# EAGLE design Mini-RS485_RJ45-GW-v01 (EAGLE 8.5.1)
MAPLE-CUx Large Version
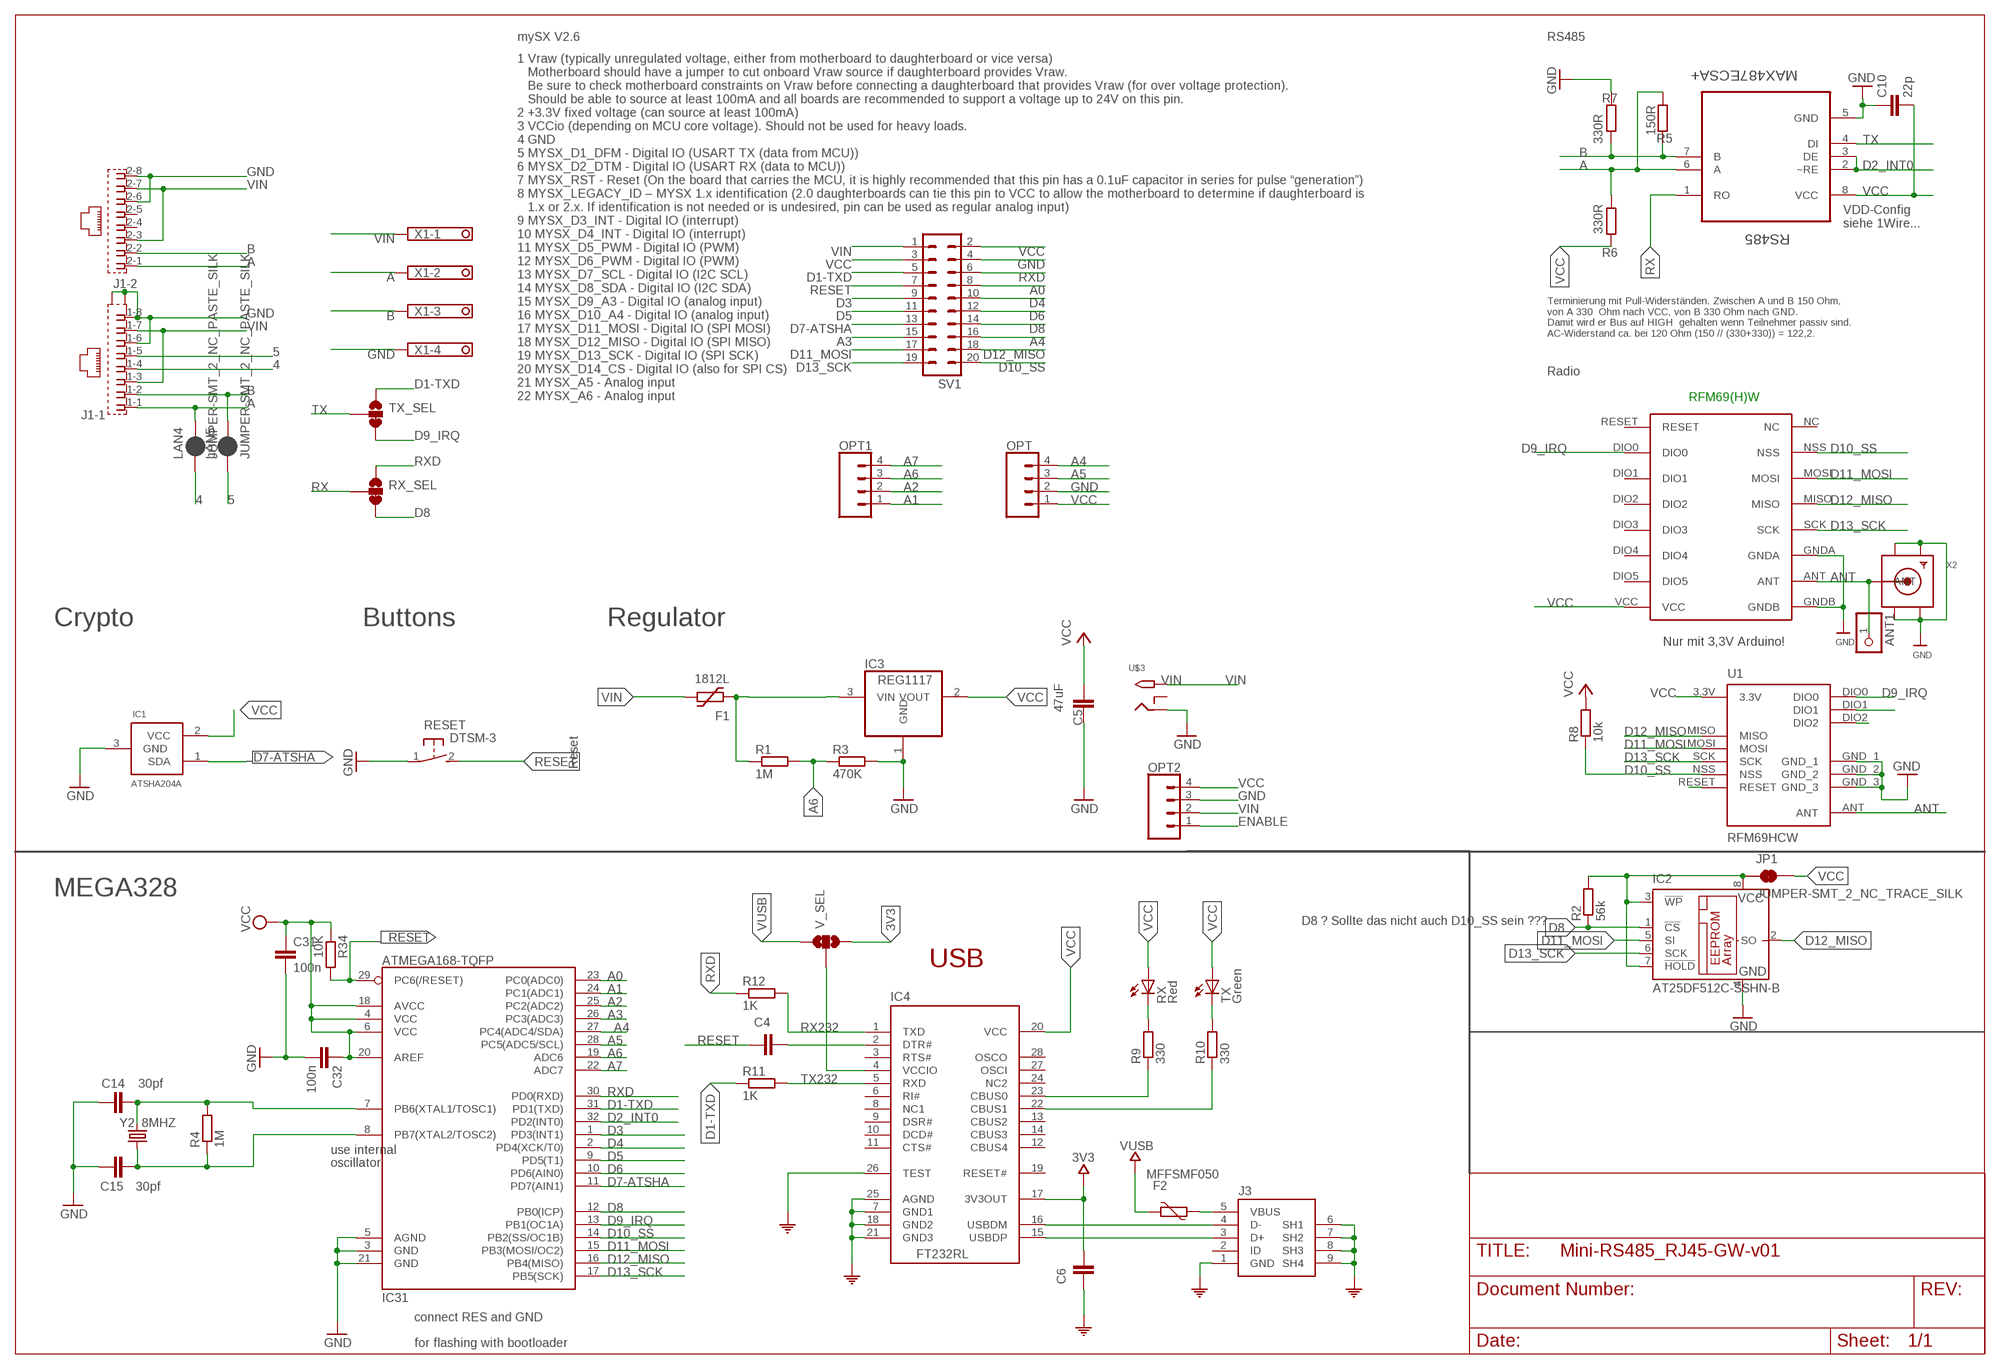
[diagram p0: schematic, sheet 1]

## Parts
ANT1  PINHD-1X1  [1X01]
C4  100nF  C-EUC0805  [C0805]
C5  47uF  C-EUC1210  [C1210]
C6  100nF  C-EUC0805  [C0805]
C10  22p  C-EUC0805  [C0805]
C14  30pf  CAP0805  [0805]
C15  30pf  CAP0805  [0805]
C31  100n  C-EUC0805  [C0805]
C32  100n  C-EUC0805  [C0805]
F1  1812L  [1812L]
F2  MFFSMF050  PTC  [0603-1608X90N]
IC1  ATSHA204A  [SOT23]
IC2  AT25DF512C-SSHN-B  25AA080SN  [SO-08]
IC3  REG1117  [SOT223]
IC4  FT232RL  0226_FT232RL  [SSOP28]
IC31  ATMEGA168-TQFP  [TQFP32-08]
J1  RJ45_2X_NARROW_SHILDPINS  [RJ45_2X_NARROW_SHILDPINS]
J3  0219_14850  [USB-MINI-B_2]
JP1  JUMPER-SMT_2_NC_TRACE_SILK  [SMT-JUMPER_2_NC_TRACE_SILK]
LAN4  JUMPER-SMT_2_NC_PASTE_SILK  [SMT-JUMPER_2_NC_PASTE_SILK]
LAN5  JUMPER-SMT_2_NC_PASTE_SILK  [SMT-JUMPER_2_NC_PASTE_SILK]
OPT  CONN_04  [1X04]
OPT1  CONN_04  [1X04]
OPT2  CONN_04  [1X04]
R1  1M  R-EU_M0805  [M0805]
R2  56k  R-EU_M0805  [M0805]
R3  470K  R-EU_R0805  [R0805]
R4  1M  R-EU_M0805  [M0805]
R5  150R  R-EU_R0805  [R0805]
R6  330R  R-EU_R0805  [R0805]
R7  330R  R-EU_R0805  [R0805]
R8  10k  R-EU_M0805  [M0805]
R9  330  R-EU_R0805  [R0805]
R10  330  R-EU_R0805  [R0805]
R11  1K  R-EU_R0805  [R0805]
R12  1K  R-EU_R0805  [R0805]
R34  10K  R-EU_R0805  [R0805]
RESET  DTSM-3  [DTSM-3]
RFM69W  RFM69HW  [RFM]
RS485  MAX487ECSA+  [SOIC127P600X175-8N]
RX  Red  0181_KTP-2012SURCK  [CHIPLED_0805]
RX_SEL  JUMPER-SMT_3_1-NC_TRACE_SILK  [SMT-JUMPER_3_1-NC_TRACE_SILK]
SV1  MA10-2  [MA10-2]
TX  Green  0043_KPT-2012SGC  [CHIPLED_0805]
TX_SEL  JUMPER-SMT_3_1-NC_TRACE_SILK  [SMT-JUMPER_3_1-NC_TRACE_SILK]
U1  RFM69HCW  [RFM69HCW-XXXS2]
U$3  2.1MMJACKTHM  [PJ-102A]
V_SEL  JUMPER-SMT_3_NO_SILK  [SMT-JUMPER_3_NO_SILK]
X1  1751264  [1751264]
X2  SMACONNECTOR_EDGE  [SMA_EDGELAUNCH]
Y2  8MHZ  CRYSTALTXC-7A  [CRYSTAL-TXC-7A]

## Nets
3V3: C6.2 IC4.17(3V3OUT) V_SEL.3
4: J1.1-4 LAN4.1
5: J1.1-5 LAN5.1
A: J1.1-1 J1.2-1 LAN4.2 R5.1 R6.2 RS485.6(A) X1.2
A0: IC31.23(PC0(ADC0)) SV1.8
A1: IC31.24(PC1(ADC1)) OPT1.1
A2: IC31.25(PC2(ADC2)) OPT1.2
A3: IC31.26(PC3(ADC3)) SV1.15
A4: IC31.27(PC4(ADC4/SDA)) OPT.4 SV1.16
A5: IC31.28(PC5(ADC5/SCL)) OPT.3
A6: IC31.19(ADC6) OPT1.3 R1.2 R3.1
A7: IC31.22(ADC7) OPT1.4
ANT: ANT1.1 RFM69W.ANT U1.ANT X2.P(ANT)
B: J1.1-2 J1.2-2 LAN5.2 R5.2 R7.1 RS485.7(B) X1.3
COM: C6.1 IC4.7(GND1) IC4.18(GND2) IC4.21(GND3) IC4.25(AGND) IC4.26(TEST) J3.1(GND) J3.6(SH1) J3.7(SH2) J3.8(SH3) J3.9(SH4)
D1-TXD: IC31.31(PD1(TXD)) R11.1 SV1.5 TX_SEL.1
D2_INT0: IC31.32(PD2(INT0)) RS485.2(~RE) RS485.3(DE)
D3: IC31.1(PD3(INT1)) SV1.9
D4: IC31.2(PD4(XCK/T0)) SV1.10
D5: IC31.9(PD5(T1)) SV1.11
D6: IC31.10(PD6(AIN0)) SV1.12
D7-ATSHA: IC1.1(SDA) IC31.11(PD7(AIN1)) SV1.13
D8: IC2.1(!CS) IC31.12(PB0(ICP)) R2.1 RX_SEL.3 SV1.14
D9_IRQ: IC31.13(PB1(OC1A)) RFM69W.DIO0 TX_SEL.3 U1.DIO0
D10_SS: IC31.14(PB2(SS/OC1B)) R8.1 RFM69W.NSS SV1.20 U1.NSS
D11_MOSI: IC2.5(SI) IC31.15(PB3(MOSI/OC2)) RFM69W.MOSI SV1.17 U1.MOSI
D12_MISO: IC2.2(SO) IC31.16(PB4(MISO)) RFM69W.MISO SV1.18 U1.MISO
D13_SCK: IC2.6(SCK) IC31.17(PB5(SCK)) RFM69W.SCK SV1.19 U1.SCK
ENABLE: OPT2.1
GND [PWR]: C5.1 C10.1 C14.1 C15.1 C31.2 C32.2 IC1.3(GND) IC2.4(GND) IC3.1(GND) IC31.3(GND) IC31.5(AGND) IC31.21(GND) J1.1-6 J1.1-8 J1.2-6 J1.2-8 J1.G1(-1:S1) J1.G3(-1:S2) OPT2.3 OPT.2 R3.2 R7.2 RESET.1 RFM69W.GNDA RFM69W.GNDB RS485.5(GND) SV1.4 U1.GND_1 U1.GND_2 U1.GND_3 U$3.RING X1.4 X2.GND@1(GND4) X2.GND@2(GND3) X2.GND@3(GND2) X2.GND@4(GND1)
N$1: IC4.4(VCCIO) V_SEL.2
N$2: IC4.22(CBUS1) R10.1
N$3: C14.2 IC31.7(PB6(XTAL1/TOSC1)) R4.2 Y2.P$2
N$4: C4.2 IC4.2(DTR#)
N$5: IC4.15(USBDP) J3.3(D+)
N$6: IC4.16(USBDM) J3.4(D-)
N$7: R9.2 RX.C
N$8: IC4.23(CBUS0) R9.1
N$9: R10.2 TX.C
N$12: U1.DIO2
N$13: U1.RESET
N$15: U1.DIO1
N$19: C15.2 IC31.8(PB7(XTAL2/TOSC2)) R4.1 Y2.P$1
N$26: F2.2 J3.5(VBUS)
RESET: C4.1 IC31.29(PC6(/RESET)) R34.2 RESET.2 SV1.7
RX: RS485.1(RO) RX_SEL.2
RX232: IC4.1(TXD) R12.2
RXD: IC31.30(PD0(RXD)) R12.1 RX_SEL.1 SV1.6
TX: RS485.4(DI) TX_SEL.2
TX232: IC4.5(RXD) R11.2
VCC [PWR]: C5.2 C10.2 C31.1 C32.1 IC1.2(VCC) IC3.2(VOUT) IC4.20(VCC) IC31.4(VCC) IC31.6(VCC) IC31.18(AVCC) IC31.20(AREF) JP1.2 OPT2.4 OPT.1 R6.1 R8.2 R34.1 RFM69W.VCC RS485.8(VCC) RX.A SV1.2 SV1.3 TX.A U1.3.3V
VCC1 [PWR]: IC2.3(!WP) IC2.7(!HOLD) IC2.8(VCC) JP1.1 R2.2
VIN [PWR]: F1.P$2 J1.1-3 J1.1-7 J1.2-3 J1.2-7 OPT2.2 SV1.1 U$3.TIP X1.1
VIN-FUSED [PWR]: F1.P$1 IC3.3(VIN) R1.1
VUSB: F2.1 V_SEL.1
Unconnected: IC4.3(RTS#) IC4.6(RI#) IC4.8(NC1) IC4.9(DSR#) IC4.10(DCD#) IC4.11(CTS#) IC4.12(CBUS4) IC4.13(CBUS2) IC4.14(CBUS3) IC4.19(RESET#) IC4.24(NC2) IC4.27(OSCI) IC4.28(OSCO) J1.2-4 J1.2-5 J3.2(ID) RFM69W.DIO1 RFM69W.DIO2 RFM69W.DIO3 RFM69W.DIO4 RFM69W.DIO5 RFM69W.NC RFM69W.RESET U$3.RING_SW

## Notes on the sheet
- mySX V2.6 | RS485
- VDD-Config
  siehe 1Wire...
- Terminierung mit Pull-Widerständen. Zwischen A und B 150 Ohm,
  von A 330  Ohm nach VCC, von B 330 Ohm nach GND. 
  Damit wird er Bus auf HIGH  gehalten wenn Teilnehmer passiv sind.
  AC-Widerstand ca. bei 120 Ohm (150 // (330+330)) = 122,2.
- Radio
- RFM69(H)W
- 1 Vraw (typically unregulated voltage, either from motherboard to daughterboard or vice versa)
     Motherboard should have a jumper to cut onboard Vraw source if daughterboard provides Vraw. 
     Be sure to check motherboard constraints on Vraw before connecting a daughterboard that provides Vraw (for over voltage protection). 
     Should be able to source at least 100mA and all boards are recommended to support a voltage up to 24V on this pin.
  2 +3.3V fixed voltage (can source at least 100mA)
  3 VCCio (depending on MCU core voltage). Should not be used for heavy loads.
  4 GND
  5 MYSX_D1_DFM - Digital IO (USART TX (data from MCU))
  6 MYSX_D2_DTM - Digital IO (USART RX (data to MCU))
  7 MYSX_RST - Reset (On the board that carries the MCU, it is highly recommended that this pin has a 0.1uF capacitor in series for pulse “generation”)
  8 MYSX_LEGACY_ID – MYSX 1.x identification (2.0 daughterboards can tie this pin to VCC to allow the motherboard to determine if daughterboard is 
     1.x or 2.x. If identification is not needed or is undesired, pin can be used as regular analog input)
  9 MYSX_D3_INT - Digital IO (interrupt)
  10 MYSX_D4_INT - Digital IO (interrupt)
  11 MYSX_D5_PWM - Digital IO (PWM)
  12 MYSX_D6_PWM - Digital IO (PWM)
  13 MYSX_D7_SCL - Digital IO (I2C SCL)
  14 MYSX_D8_SDA - Digital IO (I2C SDA)
  15 MYSX_D9_A3 - Digital IO (analog input)
  16 MYSX_D10_A4 - Digital IO (analog input)
  17 MYSX_D11_MOSI - Digital IO (SPI MOSI)
  18 MYSX_D12_MISO - Digital IO (SPI MISO)
  19 MYSX_D13_SCK - Digital IO (SPI SCK)
  20 MYSX_D14_CS - Digital IO (also for SPI CS)
  21 MYSX_A5 - Analog input
  22 MYSX_A6 - Analog input
- Crypto | Buttons | Regulator
- Nur mit 3,3V Arduino!
- Reset
- MEGA328
- D8 ? Sollte das nicht auch D10_SS sein ???
- USB
- use internal
- oscillator
- connect RES and GND
- for flashing with bootloader

## Library data of the parts
ANT1 = pinhead:PINHD-1X1: PIN HEADER
C4 C6 = resistor:C-EU: CAPACITOR, European symbol
C5 C10 C31 C32 = rcl:C-EU: CAPACITOR, European symbol
C14 C15 = doug:CAP: Capacitor Standard 0603 ceramic capacitor, and 0.1" leaded capacitor.
F1 = ptc-littlefuse:1812L
F2 = Arduino-rcl:PTC: SMD PTC; DATASHEET: http://www.bourns.com/docs/Product-Datasheets/mffsmf.pdf; DISTRIBUTOR-LINK: http://www.digikey.com/product-detail/en/bourns-inc/MF-FSMF050X-2/MF-FSMF050X-2CT-ND/2039389; DISTRIBUTOR-PN: MF-FSMF050X-2CT-ND; MANUFACTURER: Bourns Inc; MANUFACTURER-PN: MF-FSMF050X-2
IC1 = Sensor:ATSHA204A
IC2 = microchip:25*: Serial EEPROM 4K/ 8K , SPI bus; MF: MICROCHIP; MPN: 25AA080/SN; OC_FARNELL: 1816072; OC_NEWARK: 92C7351
IC3 = burr-brown:REG1117: 800mA and 1A Low Dropout (LDO) Positive Regulator 1.8V, 2.5V, 2.85V, 3.3V, 5V, and Adj; MPN: REG1117; OC_FARNELL: 1097566; OC_NEWARK: 14P6981
IC4 = IntegratedCircuits:0226_FT232RL: USB to serial UART interface -FT232RL; CASE: SSOP28; MONTHLY_USAGE: _____; PART_NUMBER: FT232RL; PRICE: _____; SUPPLIER: _____; TYPE: Circuito_Integrato
IC31 = atmel:ATMEGA168: Atmel Atmega 168/328/328P
J1 = RJ45:RJ45_2X_NARROW_SHILDPINS: RJ45 connector
J3 = Connettori:0219_14850: Usb-Mini F 90 Smd; MONTHLY_USAGE: _____; PART_NUMBER: 14850; PRICE: _____; SUPPLIER: _____; TYPE: Connettori; VALUE: USB-mini-90 -SMD
JP1 = SparkFun-Jumpers:JUMPER-SMT_2_NC_TRACE: Normally closed trace jumper This jumper has a trace between two pads so it's normally closed (NC). Use a razor knife to open the connection. For best results follow the IPC guidelines for cutting traces: Cutout at least 0.063 mm (0.005 in). Remove all loose material to clean up the cut area. Seal the cut with an approved epoxy. Reapply solder to reclose the connection.
LAN4 LAN5 = SparkFun-Jumpers:JUMPER-SMT_2_NC_PASTE: Normally closed solder jumper This jumper has an aperture in the stencil to allow solder paste to bridge the split in the wire so it's normally closed (NC). Wick off the solder to open the connection. Reapply solder to reclose the connection.
OPT OPT1 OPT2 = SparkFun-Connectors:CONN_04: Multi connection point. Often used as Generic Header-pin footprint for 0.1 inch spaced/style header connections On any of the 0.1 inch spaced packages, you can populate with these: Break Away Headers - Straight <https://www.sparkfun.com/products/116> (PRT-00116) Break Away Male Headers - Right Angle <https://www.sparkfun.com/products/553> (PRT-00553) Female Headers <https://www.sparkfun.com/products/115> (PRT-00115) Break Away Headers - Machine Pin <https://www.sparkfun.com/products/117> (PRT-00117) Break Away Female Headers - Swiss Machine Pin <https://www.sparkfun.com/products/743> (PRT-00743) For SCREWTERMINALS and SPRING TERMINALS visit here: Screw Terimnals on SparkFun.com <https://www.sparkfun.com/search/results?term=Screw+Terminals> (5mm/3.5mm/2.54mm spacing) This device is also useful as a general connection point to wire up your design to another part of your project. Our various solder wires solder well into these plated through hole pads. Hook-Up Wire - Assortment (Stranded, 22 AWG) <https://www.sparkfun.com/products/11375> (PRT-11375) Hook-Up Wire - Assortment (Solid Core, 22 AWG) <https://www.sparkfun.com/products/11367> (PRT-11367) View the entire wire category on our website here <https://www.sparkfun.com/categories/141> Special notes: Molex polarized connector foot print use with SKU : PRT-08231 with associated crimp pins and housings. 1MM SMD Version SKU: PRT-10208; PROD_ID: CONN-09696
R1 R3-R8 R34 = rcl:R-EU_: RESISTOR, European symbol
R2 R9-R12 = resistor:R-EU_: RESISTOR, European symbol
RESET = mechanics:DTSM-3: Diptronics SMD button 6x3.5 mm
RFM69W = hoperf:RFM69HW
RS485 = Maxim_By_element14_Batch_1:MAX487ECSA+: Low-Power, Slew-Rate-Limited RS-485/RS-422 Transceivers; MPN: MAX487ECSA+; OC_FARNELL: 9724532; OC_NEWARK: 68K4803; PACKAGE: SOIC-8; SUPPLIER: Maxim
RX = Opto:0181_KTP-2012SURCK: LED RED - SMD - 0805; MONTHLY_USAGE: _____; PART_NUMBER: KTP-2012SURCK; PRICE: _____; SUPPLIER: _____; TYPE: Opto
RX_SEL TX_SEL = SparkFun-Jumpers:JUMPER-SMT_3_1-NC_TRACE: Normally closed trace jumper (1 of 2 connections) This jumper has a trace between two pads so it's normally closed (NC). The other connection is normally open (NO). Use a razor knife to open the connection. For best results follow the IPC guidelines for cutting traces: Cutout at least 0.063 mm (0.005 in). Remove all loose material to clean up the cut area. Seal the cut with an approved epoxy. Reapply solder to reclose the connection, or to close the NO connection.
SV1 = con-lstb:MA10-2: PIN HEADER; OC_FARNELL: unknown; OC_NEWARK: unknown
TX = Opto:0043_KPT-2012SGC: LED GREEN - SMD-0805; MONTHLY_USAGE: _____; PART_NUMBER: KPT-2012SGC; PRICE: _____; SUPPLIER: _____; TYPE: Opto
U1 = doug:RFM69H
U$3 = adafruit:2.1MMJACK: 2.1mm x 5.5mm THM DC jack with internal switch. Digikey part #PJ-102A, 4UCON part #05537 2.1mm x 5.5mm SMT DC jack with internal switch. Digikey part #PJ-002A-SMT, 4UCON part #03267 By microbuilder.eu & adafruit.com
V_SEL = SparkFun-Jumpers:JUMPER-SMT_3_NO: Normally open jumper This jumper has three pads in close proximity to each other. Apply solder to close the connection(s).
X1 = con-phoenix-350:1751264: MKDS 1/ 4-3,5 Printklemme Nennstrom: 10 A Bemessungsspannung: 160 V Raster: 3,5 mm Polzahl: 4 Montageart: Löten Anschlussart: Schraubanschluss Anschlussrichtung vom Leiter zur Platine: 0° Source: http://eshop.phoenixcontact.com .. 1751264.pdf; MPN: 1751264; OC_FARNELL: unknown; OC_NEWARK: 10R0934
X2 = adafruit:SMACONNECTOR: SMA Connector 90° DIP SMA Connector, 50 Ohm (4UConnector: 07259)
Y2 = SparkFun-FreqCtrl:CRYSTAL: Various standard crystals. Proven footprints.

## Net classes
0 default: width 0.254 mm
1 PWR: width 0.406 mm

## Board
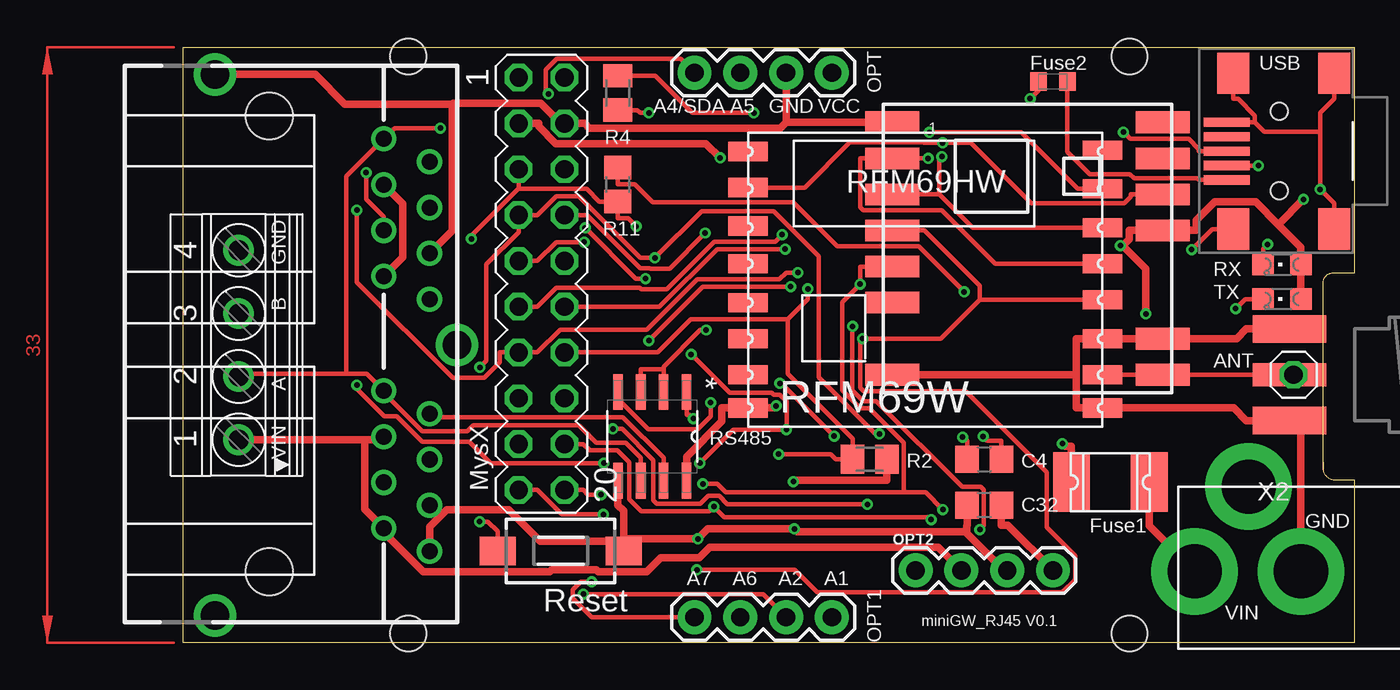
[diagram p1: board, top side]
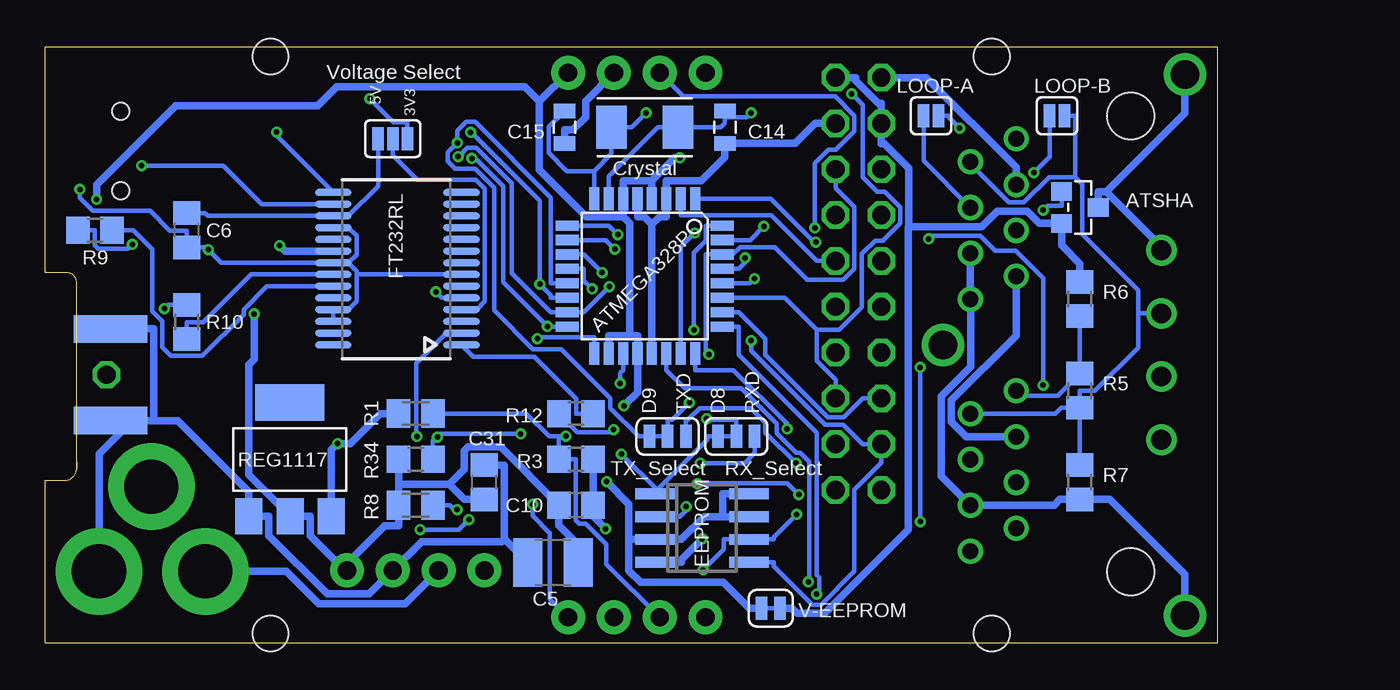
[diagram p2: board, bottom side, seen from below]

Size 65 x 33 mm. Coordinates in mm from the lower left corner, seen from the top.
Outline: 63.25,9.6 arc90 64,9 65,9 65,0 0,0 0,33 65,33 65,20.5 63.8,20.5 arc90 63.25,20 63.25,9.6
Outline: 63.25,9.6 63.25,10 63.25,9.6
Copper layers (1*16): Top 0.035mm / dielectric 1.5mm / Bottom 0.035mm
Design rules "SeeedStudio_2layer_DRU_no_angle_20140221": minimum track width 6mil, minimum drill 12mil, track to track 6mil, track to pad 6mil, pad to pad 6mil, via to via 6mil, smd to smd 0mil, copper to edge 10mil, drill to drill 10mil, minimum pad ring 10mil, minimum via ring 6mil, stop-mask expansion 2mil, vias tented up to drill 100mil, thermal gap 10mil
Holes 2 mm at 52.5,0.5 52.5,32.5 12.5,0.5 12.5,32.5
tRestrict: area 50.3,-1.7 to 54.7,2.7; area 50.3,30.3 to 54.7,34.7; area 10.3,30.3 to 14.7,34.7; area 10.3,-1.7 to 14.7,2.7
bRestrict: area 10.3,-1.7 to 14.7,2.7; area 50.3,-1.7 to 54.7,2.7; area 50.3,30.3 to 54.7,34.7; area 10.3,30.3 to 14.7,34.7

### Footprints (pad centres in the part's own frame; a part is rotated, then mirrored left to right if it is on the bottom)
1X01 = drill 1.016 octagon: 1 0,0
C0805 = smd 1.3 x 1.5: 1 -0.95,0; 2 0.95,0
C1210 = smd 1.6 x 2.7: 1 -1.4,0; 2 1.4,0
0805 = smd 0.8 x 1.2: 1 -0.9,0; 2 0.9,0
1812L = smd 2.03 x 3.3: P$1 -2.16,0; P$2 2.16,0
0603-1608X90N = smd 0.95 x 1: 1 -0.8,0; 2 0.8,0
SOT23 = smd 1.016 x 1.143: 1 -0.889,-1.016; 2 0.889,-1.016; 3 0,1.016
SO-08 = smd 0.6 x 2.2: 1 -1.905,-2.6; 2 -0.635,-2.6; 3 0.635,-2.6; 4 1.905,-2.6; 5 1.905,2.6; 6 0.635,2.6; 7 -0.635,2.6; 8 -1.905,2.6
SOT223 = smd 1.499 x 2.007: 1 -2.261,-3.15; 2 0.025,-3.15; 3 2.311,-3.15 | smd 3.81 x 2.007: 4 0,3.15
SSOP28 = smd 0.381 x 2.032: 1 0,0; 2 0.65,0; 3 1.3,0; 4 1.95,0; 5 2.6,0; 6 3.25,0; 7 3.9,0; 8 4.55,0; 9 5.2,0; 10 5.85,0; 11 6.5,0; 12 7.15,0; 13 7.8,0; 14 8.45,0; 15 8.45,7.112; 16 7.8,7.112; 17 7.15,7.112; 18 6.5,7.112; 19 5.85,7.112; 20 5.2,7.112; 21 4.55,7.112; 22 3.9,7.112; 23 3.25,7.112; 24 2.6,7.112; 25 1.95,7.112; 26 1.3,7.112; 27 0.65,7.112; 28 0,7.112
TQFP32-08 = smd 1.27 x 0.559: 1 -4.293,2.8; 2 -4.293,2; 3 -4.293,1.2; 4 -4.293,0.4; 5 -4.293,-0.4; 6 -4.293,-1.2; 7 -4.293,-2; 8 -4.293,-2.8; 17 4.293,-2.8; 18 4.293,-2; 19 4.293,-1.2; 20 4.293,-0.4; 21 4.293,0.4; 22 4.293,1.2; 23 4.293,2; 24 4.293,2.8 | smd 0.559 x 1.27: 9 -2.8,-4.293; 10 -2,-4.293; 11 -1.2,-4.293; 12 -0.4,-4.293; 13 0.4,-4.293; 14 1.2,-4.293; 15 2,-4.293; 16 2.8,-4.293; 25 2.8,4.293; 26 2,4.293; 27 1.2,4.293; 28 0.4,4.293; 29 -0.4,4.293; 30 -1.2,4.293; 31 -2,4.293; 32 -2.8,4.293
RJ45_2X_NARROW_SHILDPINS = drill 0.889: 1-1 -11.43,6.35; 1-2 -10.16,8.89; 1-3 -8.89,6.35; 1-4 -7.62,8.89; 1-5 -6.35,6.35; 1-6 -5.08,8.89; 1-7 -3.81,6.35; 1-8 -2.54,8.89; 2-1 2.54,6.35; 2-2 3.81,8.89; 2-3 5.08,6.35; 2-4 6.35,8.89; 2-5 7.62,6.35; 2-6 8.89,8.89; 2-7 10.16,6.35; 2-8 11.43,8.89 | drill 1.575 pad 2.184: G1 -15,-3; G2 0,10.414; G3 15,-3 | hole 2.6: -12.7,0; 12.573,0
USB-MINI-B_2 = smd 0.508 x 2.54: 1 0,0; 2 0.8,0; 3 1.6,0; 4 2.4,0; 5 3.2,0 | smd 2.286 x 1.778: 6 -2.717,5.948; 7 -2.717,0.36; 8 5.918,0.36; 9 5.918,5.948 | hole 0.95: -0.6,2.9; 3.8,2.9
SMT-JUMPER_2_NC_TRACE_SILK = smd 0.635 x 1.27: 1 -0.508,0; 2 0.508,0
SMT-JUMPER_2_NC_PASTE_SILK = smd 0.635 x 1.27: 1 -0.406,0; 2 0.406,0
1X04 = drill 1.016 pad 1.88: 1 0,0; 2 2.54,0; 3 5.08,0; 4 7.62,0
M0805 = smd 1.3 x 1.6: 1 -0.95,0; 2 0.95,0
R0805 = smd 1.3 x 1.5: 1 -0.95,0; 2 0.95,0
DTSM-3 = smd 2 x 1.6: 1 -3.494,0; 2 3.494,0
RFM = smd 2.184 x 1.067: ANT 19.651,2.889; DIO0 0,13.27; DIO1 0,11.143; DIO2 0,9.047; DIO3 0,6.889; DIO4 0,4.889; DIO5 0,2.889; GNDA 19.651,4.889; GNDB 19.651,1.048; MISO 19.651,9.047; MOSI 19.651,11.047; NC 19.651,15.334; NSS 19.651,13.206; RESET 0,15.27; SCK 19.651,7.048; VCC 0,1.048
SOIC127P600X175-8N = smd 1.981 x 0.533: 1 -2.464,1.905; 2 -2.464,0.635; 3 -2.464,-0.635; 4 -2.464,-1.905; 5 2.464,-1.905; 6 2.464,-0.635; 7 2.464,0.635; 8 2.464,1.905
CHIPLED_0805 = smd 1.2 x 1.2: A 0,-1.05; C 0,1.05
SMT-JUMPER_3_1-NC_TRACE_SILK = smd 0.635 x 1.27: 1 -1.016,0; 2 0,0; 3 1.016,0
MA10-2 = drill 1.016 octagon: 1 -11.43,-1.27; 2 -11.43,1.27; 3 -8.89,-1.27; 4 -8.89,1.27; 5 -6.35,-1.27; 6 -6.35,1.27; 7 -3.81,-1.27; 8 -3.81,1.27; 9 -1.27,-1.27; 10 -1.27,1.27; 11 1.27,-1.27; 12 1.27,1.27; 13 3.81,-1.27; 14 3.81,1.27; 15 6.35,-1.27; 16 6.35,1.27; 17 8.89,-1.27; 18 8.89,1.27; 19 11.43,-1.27; 20 11.43,1.27
RFM69HCW-XXXS2 = smd 3 x 1.2: 3.3V 7.5,1; ANT 7.5,-7; DIO0 7.5,3; DIO1 7.5,5; DIO2 7.5,7; GND_1 7.5,-5; GND_2 -7.5,-7; GND_3 -7.5,7; MISO -7.5,5; MOSI -7.5,3; NSS -7.5,-1; RESET -7.5,-3; SCK -7.5,1
PJ-102A = drill 3 pad 4.8: RING 0.1,-3.39; RING_SW -4.6,-6.29; TIP 0.1,-9.29
SMT-JUMPER_3_NO_SILK = smd 0.635 x 1.27: 1 -0.813,0; 2 0,0; 3 0.813,0
1751264 = drill 1.1 pad 1.7: 1 -5.25,-0.1; 2 -1.75,-0.1; 3 1.75,-0.1; 4 5.25,-0.1
SMA_EDGELAUNCH = smd 4.064 x 1.524: GND@1 2.032,-2.54; GND@2 2.032,2.54 | smd 4.064 x 1.524 bottom: GND@3 2.032,2.54; GND@4 2.032,-2.54 | smd 4.064 x 1.27: P 2.032,0
CRYSTAL-TXC-7A = smd 1.7 x 2.4: P$1 1.85,0; P$2 -1.85,0

### Placement (x,y rotation side)
ANT1  61.6,14.85 0 top
C4  44.45,10.16 0 top
C5  36.83,4.45 0 bottom
C6  57.15,22.86 90 bottom
C10  35.56,7.62 180 bottom
C14  27.3,28.57 90 bottom
C15  36.2,28.57 90 bottom
C31  40.64,8.89 90 bottom
C32  44.45,7.62 180 top
F1  51.44,8.89 0 top
F2  48.26,31.11 0 top
IC1  7.62,24.13 270 bottom
IC2  28.57,6.35 270 bottom
IC3  51.44,10.16 0 bottom
IC4  41.91,16.51 90 bottom
IC31  31.75,20.32 270 bottom
J1  4.8,16.5 270 top
J3  57.9,28.85 270 top
JP1  24.77,1.91 0 bottom
LAN4  15.88,29.21 0 bottom
LAN5  8.89,29.21 0 bottom
OPT  36,31.6 180 top
OPT1  36,1.4 180 top
OPT2  40.64,4 0 top
R1  44.45,12.7 0 bottom
R2  38.1,10.16 0 top
R3  35.56,10.16 0 bottom
R4  24.13,30.48 270 top
R5  7.62,13.97 270 bottom
R6  7.62,19.05 270 bottom
R7  7.62,8.89 270 bottom
R8  44.45,7.62 180 bottom
R9  62.23,22.86 180 bottom
R10  57.15,17.78 90 bottom
R11  24.13,25.4 90 top
R12  35.56,12.7 0 bottom
R34  44.45,10.16 0 bottom
RESET  20.95,5.08 180 top
RFM69W  31.35,11.96 0 top
RS485  26.04,11.43 270 top
RX  60.96,20.95 90 top
RX_SEL  26.67,11.43 180 bottom
SV1  19.9,19.89 270 top
TX  60.96,19.05 90 top
TX_SEL  30.48,11.43 180 bottom
U1  46.85,21.85 0 top
U$3  65.4,4.05 270 top
V_SEL  45.72,27.94 180 bottom
X1  3,16.5 90 top
X2  63.4,14.85 180 top
Y2  31.75,28.57 180 bottom

### Tracks (layer width: path | path; a pad name or v marks a point on that pad's centre or on a via)
3V3
  Bottom 0.254: C6.2 56.12,23.81 55.97,23.66 IC4.17 48.18,23.66 46.53,25.31 46.53,27.03 V_SEL.3
4
  Bottom 0.254: LAN4.1 16.28,26.71 J1.1-4
5  (via drill 0.3 pad 0.61)
  Top 0.254: J1.1-5 11.15,23.61 10.17,24.59 v10.17,26.06
  Bottom 0.254: LAN5.1 9.3,26.93 v10.17,26.06
A  (via drill 0.3 pad 0.61)
  Top 0.254: 9.07,14.9 10.21,14.9 J1.2-1 11.15,13.84 13.28,11.71 15.78,11.71 16.11,12.05 21.95,12.05 22.93,11.07 24.57,11.07 25.4,10.24 RS485.6 | X1.2 3.25,14.9 9.07,14.9 | 9.07,14.9 9.07,25.85 J1.1-1 11.75,28.53 v14.29,28.53
  Bottom 0.254: J1.2-1 10.88,13.69 8.85,13.69 R5.1 7.62,15.85 7.62,17.17 R6.2 | v14.29,28.53 14.87,29.11 14.87,29.21 LAN4.2
A0  (via drill 0.3 pad 0.61)
  Top 0.254: v28.98,22.71 27.01,20.74 25.93,20.74 25.91,20.77 25.37,20.77 22.43,23.7 22.21,23.7 SV1.8
  Bottom 0.254: IC31.23 29.75,21.94 v28.98,22.71
A1  (via drill 0.3 pad 0.61)
  Top 0.254: v37.97,7.67 30.2,7.67 29.74,8.13 29.13,8.13 28.7,7.7 26.29,7.7 26.09,7.89 26.09,10.12 24.36,11.85 v23.85,11.85
  Bottom 0.254: v23.85,11.85 23.85,12.13 26.84,15.11 28.95,15.11 IC31.24 | OPT1.1 37.01,2.41 37.01,6.07 37.97,7.04 v37.97,7.67
A2  (via drill 0.3 pad 0.61)
  Top 0.254: OPT1.2 32.18,2.68 22.22,2.68 v22.21,2.69
  Bottom 0.254: v22.21,2.69 22.09,2.82 22.09,3.61 22.21,3.74 22.21,11.64 26.54,15.97 26.54,17.52 IC31.25
A3
  Bottom 0.254: IC31.26 26.54,18.32 25.06,16.84 25.06,15.96 21.6,12.5 20.72,12.5 19.67,13.54 SV1.15
A4  (via drill 0.3 pad 0.61)
  Top 0.254: v20.28,30.42 20.13,30.57 20.13,31.76 20.74,32.37 27.61,32.37 OPT.4
  Bottom 0.254: 22.22,17.36 20.96,17.36 19.72,18.6 19.72,21.55 18.98,22.29 18.56,22.29 17.59,23.27 17.59,24.14 18.45,25 18.86,25 19.67,25.81 19.67,29.82 v20.28,30.42 | 22.22,17.36 23.98,19.12 26.54,19.12 IC31.27 | 22.22,17.36 22.22,15.63 21.17,14.59 SV1.16
A5  (via drill 0.3 pad 0.61)
  Top 0.254: v22.32,22.99 25.12,20.18 v25.66,20.18
  Bottom 0.254: v25.66,20.18 25.92,19.92 IC31.28 | OPT.3 29.6,30.28 21.2,30.28 20.13,29.21 20.13,28.35 21.16,27.32 21.57,27.32 22.32,26.58 v22.32,22.99
A6  (via drill 0.3 pad 0.61)
  Top 0.254: v33.11,14.37 33.2,14.37 v36.12,11.45
  Bottom 0.254: OPT1.3 33.88,4.36 33.88,5.44 35.03,6.59 35.38,6.59 35.58,6.79 35.58,10.16 R3.1 36.51,10.68 36.51,11.19 36.51,11.43 | 36.51,11.43 37.04,11.43 38.31,12.7 42.57,12.7 R1.2 | 36.51,11.43 36.14,11.43 v36.12,11.45 | IC31.19 32.95,15.11 33.11,14.95 v33.11,14.37
A7  (via drill 0.3 pad 0.61)
  Top 0.254: OPT1.4 22.68,1.4 21.63,2.45 21.63,2.93 22.06,3.37 v22.67,3.37
  Bottom 0.254: v22.67,3.37 22.62,3.42 22.62,10.04 23.11,10.53 23.36,10.53 24.43,11.61 24.43,12.13 26.41,14.11 29.54,14.11 30.55,15.11 IC31.22
ANT
  Top 0.254: RFM69W.ANT 52.37,14.85 U1.ANT X2.P ANT1.1
B
  Top 0.254: J1.2-2 13.88,12.5 24.41,12.5 26.67,10.24 RS485.7
  Bottom 0.254: 4.39,18.25 4.39,16.36 6.79,13.95 7.62,13.95 R5.2 | 7.89,25.81 7.5,25.42 7.5,22.65 4.39,19.54 4.39,18.25 | 4.39,18.25 X1.3 | R5.2 8.65,13.02 8.98,12.69 J1.2-2 | R5.2 R7.1 | 7.89,25.81 9.33,25.81 10.72,24.41 11.56,24.41 13.69,26.55 J1.1-2 | 7.89,25.81 7.89,29.21 LAN5.2
COM  (via drill 0.3 pad 0.61)
  Top 0.254: 63.07,28.34 63.07,29.37 63.85,30.14 J3.6 | 63.07,28.34 v63.07,25.13 63.85,24.35 J3.9 | 63.07,28.34 59.96,28.34 59.45,28.85 | J3.1 59.45,28.85 | J3.7 58.26,30.14 58.53,30.14 59.45,29.22 59.45,28.85 | v55.94,21.78 57.09,22.93 J3.8 | v55.94,21.78
  Bottom 0.254: v63.07,25.13 63.07,24.66 62.34,23.94 59.18,23.94 58.08,22.84 57.15,22.84 C6.1 56.07,21.91 v55.94,21.78 55.22,21.06 IC4.21 48.18,21.06 | 48.18,21.06 47.72,20.6 47.72,20.41 | 48.18,21.06 47.73,21.52 47.73,22.55 48.19,23.01 IC4.18 | 47.72,20.41 47.72,18.92 48.18,18.46 IC4.25 IC4.26 | 47.72,20.41 IC4.7
D1-TXD  (via drill 0.3 pad 0.61)
  Top 0.254: 18.63,25.15 SV1.5 | v16,22.39 16,22.55 18.6,25.15 18.63,25.15 | 18.63,25.15 22.4,25.15 23.1,24.45 R11.1 24.13,23.52 24.7,23.52 v25.14,23.08 | v9.66,14.28 9.66,14.07 11.18,12.55 11.87,12.55 13.29,11.13 15.9,11.13 17.08,9.95 v23.36,9.95
  Bottom 0.254: v23.36,9.95 25.06,11.65 25.06,12.18 25.87,13 28.7,13 29.36,12.34 29.46,12.34 TX_SEL.1 | v9.66,14.28 9.66,20.2 11.18,21.72 12.31,21.72 13.14,22.56 15.83,22.56 v16,22.39 | v25.14,23.08 25.9,22.32 26.54,22.32 27,22.32 IC31.31
D2_INT0  (via drill 0.3 pad 0.61)
  Top 0.254: 26.67,15.16 26.67,15.3 28.7,17.33 v29.02,17.33 | 26.67,15.16 25.4,15.16 RS485.3 | RS485.2 26.67,15.16
  Bottom 0.254: v29.02,17.33 29.02,21.63 28.37,22.28 28.37,23.12 IC31.32
D3  (via drill 0.3 pad 0.61)
  Top 0.254: v22.26,22.21 20.71,22.21 19.67,21.16 SV1.9
  Bottom 0.254: IC31.1 24.77,24.61 22.36,22.21 v22.26,22.21
D4
  Bottom 0.254: IC31.2 29.75,23.7 24.75,23.7 22.21,21.16 SV1.10
D5  (via drill 0.3 pad 0.61)
  Top 0.254: v33.24,22.62 32.85,22.23 29.46,22.23 26.83,19.6 25.42,19.6 25.35,19.67 20.71,19.67 19.67,18.62 SV1.11
  Bottom 0.254: v33.24,22.62 33.74,23.12 IC31.9
D6  (via drill 0.3 pad 0.61)
  Top 0.254: v33.4,21.82 29.63,21.82 26.44,18.62 22.21,18.62 SV1.12
  Bottom 0.254: IC31.10 33.9,22.32 v33.4,21.82
D7-ATSHA  (via drill 0.3 pad 0.61)
  Top 0.254: v9.66,23.98 9.66,19.99 14.97,14.67 16.72,14.67 17.59,15.54 17.59,16.09 SV1.13 19.67,16.09 20.94,17.36 25.74,17.36 28.53,20.14 33.09,20.14 33.46,20.51 v34.12,20.51
  Bottom 0.254: v34.12,20.51 35.13,21.52 IC31.11 | IC1.1 8.64,24.23 9.4,24.23 v9.66,23.98
D8  (via drill 0.3 pad 0.61)
  Top 0.254: 33.55,17.92 28.18,17.92 26.34,16.09 22.21,16.09 SV1.14 | 33.55,17.92 33.55,14.91 37.15,11.31 R2.1 36.22,10.16 35.93,10.46 v33.04,10.46 | v34.67,19.61 34.67,19.05 33.55,17.92
  Bottom 0.254: IC31.12 35.13,20.72 35.13,20.07 v34.67,19.61 | 31.06,8.47 v33.04,10.46 | IC2.1 31.18,8.32 31.06,8.43 31.06,8.47 | 31.06,8.47 | 31.06,8.47 28.28,11.25 28.28,11.43 RX_SEL.3
D9_IRQ  (via drill 0.3 pad 0.61)
  Top 0.254: RFM69W.DIO0 34.5,25.23 37,27.73 41.07,27.73 41.1,27.7 v42.13,27.7 43.69,27.7 47.04,24.35 52.21,24.35 52.57,24.71 52.57,24.85 U1.DIO0
  Bottom 0.254: IC31.13 36.96,19.92 36.96,24.68 41.16,28.88 41.65,28.88 42.13,28.39 v42.13,27.7 42.16,27.7 42.68,27.18 42.68,26.7 42.25,26.27 41.15,26.27 40.1,25.22 40.1,18.42 37.95,16.27 36.37,16.27 33.66,13.56 33.66,13 32.09,11.43 TX_SEL.3
D10_SS  (via drill 0.3 pad 0.61)
  Top 0.254: 39.98,8.33 41.2,8.33 v42.15,7.37 | v28.84,8.8 29.66,8.8 30.12,8.33 39.98,8.33 | 39.98,8.33 39.98,11.07 38.07,12.99 37.56,12.99 36.56,13.99 36.56,18.87 v37.57,19.88 37.57,20.85 U1.NSS | SV1.20 22.21,8.46 22.47,8.2 v23.21,8.2 | RFM69W.NSS 49.63,25.17 46.51,28.29 v41.4,28.29
  Bottom 0.254: v41.4,28.29 41.37,28.29 37.57,24.49 v37.57,19.88 36.96,19.27 36.96,19.12 IC31.14 | R8.1 42.57,7.62 42.33,7.37 v42.15,7.37 | v23.21,8.2 23.84,8.83 28.8,8.83 v28.84,8.8
D11_MOSI  (via drill 0.3 pad 0.61)
  Top 0.254: 41.96,24.85 41.96,26.8 v42.1,26.94 | v25.85,16.74 28.84,19.74 v33.71,19.74 | 41.96,24.85 U1.MOSI | RFM69W.MOSI 43.8,23.01 41.96,24.85
  Bottom 0.254: v42.1,26.94 42.07,26.94 41.58,27.43 41.09,27.43 39.13,25.47 39.13,20.49 36.96,18.32 36.47,18.32 IC31.15 35.13,18.32 v33.71,19.74 | v25.85,16.74 25.85,16.17 21.75,12.07 20.74,12.07 19.67,11.01 SV1.17 18.63,9.96 20.13,8.46 20.13,3.95 21.97,2.1 22.46,2.1 24.6,4.24 24.6,4.45 IC2.5
D12_MISO  (via drill 0.3 pad 0.61)
  Top 0.254: v41.34,26.85 41.13,26.85 U1.MISO 37.57,26.85 37.57,24.13 37.73,23.97 42.1,23.97 45.06,21.01 49.63,21.01 RFM69W.MISO | v44.21,6.26 44.43,6.48 44.43,8.49 44.27,8.65 43.22,8.65 38.47,13.39 37.73,13.39 37.12,14 37.12,17.52 v37.14,17.54 | SV1.18 22.21,11.01 22.56,10.65 24.1,10.65 24.77,9.98 24.77,7.95 25.42,7.29 29.2,7.29 v29.45,7.54 30.04,6.95 41.36,6.95 v41.49,6.82
  Bottom 0.254: v41.34,26.85 41.15,26.85 39.6,25.3 39.6,19.99 v37.14,17.54 36.97,17.54 36.96,17.52 IC31.16 | v29.45,7.54 29.45,7.33 29.8,6.99 IC2.2 | v41.49,6.82 42.06,6.26 v44.21,6.26
D13_SCK  (via drill 0.3 pad 0.61)
  Top 0.254: v28.51,4.03 33.93,4.03 35.17,2.78 48.77,2.78 49.48,3.49 49.48,4.81 47.91,6.39 47.91,9.45 43.43,13.93 37.77,13.93 37.57,14.13 37.57,16.71 v37.71,16.85 42.03,16.85 44.19,19.01 | 44.19,19.01 44.19,19.79 41.13,22.85 U1.SCK | 44.19,19.01 49.99,19.01 RFM69W.SCK | v23.33,7.11 21.03,7.11 19.67,8.46 SV1.19
  Bottom 0.254: v28.51,4.03 27.35,5.18 27.35,5.71 IC2.6 25.29,5.71 24.6,5.71 24.6,5.84 v23.33,7.11 | IC31.17 34.55,16.94 37.62,16.94 v37.71,16.85
GND  (via drill 0.3 pad 0.61)
  Top 0.406: 43.47,6.15 43.47,6.49 43.5,6.51 C32.2 | OPT2.3 45.53,4 43.47,6.05 43.47,6.15 | 43.47,6.15 34.07,6.15 v33.91,6.31 29.12,6.31 v28.56,5.75 24.59,5.75 24.45,5.61 | 33.46,28.85 OPT.2 | 33.46,28.85 33.13,28.52 22.55,28.52 22.29,28.79 SV1.4 20.97,28.79 19.85,29.91 15.02,29.91 14.95,29.84 | 33.46,28.85 37.49,28.85 U1.GND_3 | J1.G1 7.34,31.5 9,29.84 14.95,29.84 | 14.95,29.84 14.95,22.84 J1.1-6 | 14.29,7.01 13.69,6.41 J1.2-8 | 24.45,5.61 19.84,5.61 18.08,7.37 14.64,7.37 14.29,7.01 | J1.2-6 14.29,7.01 | X2.GND@1 58.98,17.39 58.44,16.85 U1.GND_1 52.45,16.85 RFM69W.GNDA 49.55,16.85 49.55,14.85 | 49.55,14.85 49.55,13.01 RFM69W.GNDB 58.28,13.01 58.98,12.31 X2.GND@2 62.01,11.67 U$3.RING | 49.55,14.85 41.21,14.85 U1.GND_2 | 24.45,5.61 24.45,6.24 24.45,7.3 24.13,7.62 RS485.5 | RESET.1 24.45,5.61
  Bottom 0.406: 60.17,12.31 62.01,10.47 U$3.RING | 60.17,12.31 58.98,12.31 | X2.GND@2 60.17,12.31 | 58.98,12.31 57.64,12.31 53.7,8.37 IC3.1 52.59,7.01 52.59,5.93 49.36,2.7 47.02,2.7 OPT2.3 44.12,5.6 39.69,5.6 39.53,5.75 | 58.98,12.31 58.98,17.39 X2.GND@1 | 39.53,5.75 C5.1 | 39.53,5.75 39.53,9.84 C31.2 | v33.91,6.31 34.61,7.01 C10.1 R3.2 | C15.1 36.2,28.43 35.73,28.43 35.03,29.13 35.03,30.03 OPT.2 | J1.G1 1.8,29.35 6.16,24.99 | 6.16,24.99 6.6,24.99 IC1.3 | 6.16,24.99 3.1,21.93 X1.4 | SV1.4 22.29,28.79 23.4,27.68 C14.1 27.3,26.92 28.62,25.6 30.55,25.6 IC31.3 30.55,23.62 30.92,23.62 31.35,23.19 | IC2.4 29.72,4.45 29.72,4.59 v28.56,5.75 | 31.35,23.19 IC31.21 | 31.35,23.19 31.78,23.62 32.15,23.62 IC31.5 | J1.G3 1.8,3.77 5.97,7.94 R7.2 8.73,7.94 9.06,7.61 J1.2-6 15.3,9.22 15.3,13.67 13.68,15.3 13.68,19.02 J1.1-8 J1.1-6
N$1
  Bottom 0.254: V_SEL.2 45.72,27.03 44.35,25.66 41.12,25.66 40.61,25.16 40.61,18.92 41.07,18.46 IC4.4
N$2
  Bottom 0.254: R10.1 57.15,17.76 56.22,17.76 53.57,20.41 IC4.22
N$3  (via drill 0.3 pad 0.61)
  Top 0.254: R4.2 25.21,29.53 25.37,29.37 v25.85,29.37
  Bottom 0.254: 27.3,29.14 26.08,29.14 v25.85,29.37 | 27.3,29.14 27.3,28.8 27.53,28.57 Y2.P$2 31.03,28.57 33.75,25.85 33.75,25.53 IC31.7 | C14.2 27.3,29.14
N$4  (via drill 0.3 pad 0.61)
  Top 0.254: C4.2 45.4,11.19 44.63,11.19 v44.39,11.43
  Bottom 0.254: IC4.2 42.75,17.16 44.43,15.48 44.43,11.47 v44.39,11.43
N$5  (via drill 0.3 pad 0.61)
  Top 0.254: v52.16,28.3 52.53,27.93 55.78,27.93 56.35,27.36 56.35,27.25 J3.3
  Bottom 0.254: IC4.15 52.16,28.1 v52.16,28.3
N$6  (via drill 0.3 pad 0.61)
  Top 0.254: v59.64,26.45 59.45,26.45 J3.4
  Bottom 0.254: IC4.16 52.98,24.31 55.12,26.45 v59.64,26.45
N$7  (via drill 0.3 pad 0.61)
  Top 0.254: v60.16,22.08 59.91,21.83 RX.C
  Bottom 0.254: v60.16,22.08 60.41,21.82 62.04,21.82 62.25,22.03 62.25,22.86 R9.2
N$8
  Bottom 0.254: R9.1 60.11,22.86 59.06,21.8 59.06,18.37 58.5,17.81 58.5,16.38 58.02,15.9 56.28,15.9 54,18.19 54,18.47 52.7,19.76 IC4.23
N$9  (via drill 0.3 pad 0.61)
  Top 0.254: TX.C 58.91,19.05 v58.38,18.52
  Bottom 0.254: R10.2 58.18,18.73 58.18,18.72 v58.38,18.52
N$19  (via drill 0.3 pad 0.61)
  Top 0.254: R4.1 26.19,31.43 28.25,29.37 v31.68,29.37
  Bottom 0.254: 34.55,26.15 34.55,25.53 IC31.8 | 34.55,26.15 33.6,27.1 Y2.P$1 32.47,28.57 v31.68,29.37 | 34.55,26.15 36.07,26.15 37.07,27.15 37.07,28.6 C15.2
N$26
  Top 0.254: J3.5 56.35,25.65 56.25,25.75 52.75,25.75 52.52,25.98 50.29,25.98 49.06,27.21 F2.2
RESET  (via drill 0.3 pad 0.61)
  Top 0.254: v38.62,11.57 38.4,11.57 35.26,14.71 35.26,21.43 32.77,23.92 28.78,23.92 v26.18,21.33 25.38,21.33 21.96,24.75 20.71,24.75 19.67,23.7 SV1.7 18.63,23.23 18.63,22.77 16.84,20.98 16.84,15.62 v16.48,15.26 | v16.47,6.7 16.92,6.7 17.46,6.16 RESET.2 | v43.25,11.4 43.46,11.19 43.5,11.19 C4.1
  Bottom 0.254: v38.62,11.57 43.08,11.57 v43.25,11.4 43.46,11.19 43.5,11.19 C4.1 | v16.48,15.26 16.48,6.71 v16.47,6.7 | v26.18,21.33 26.18,21.08 26.54,20.72 IC31.29
RX  (via drill 0.3 pad 0.61)
  Top 0.254: v28.31,12.41 28.1,12.62 27.94,12.62 RS485.1
  Bottom 0.254: v28.31,12.41 28.24,12.34 26.67,12.34 RX_SEL.2
RX232
  Bottom 0.254: IC4.1 41.26,15.86 37.87,15.86 35.54,13.53 35.54,12.7 R12.2
RXD  (via drill 0.3 pad 0.61)
  Top 0.254: v28.19,15.99 30.32,13.85 32.66,13.85 32.76,13.75 33.11,13.75 33.49,13.38 v33.49,11.81 v33.48,11.81 30.53,11.81 v28.68,9.96
  Bottom 0.254: SV1.6 21.17,25.2 20.13,24.16 20.13,20.73 20.73,20.12 22.75,20.12 24.54,21.91 26.46,21.91 26.86,21.52 IC31.30 28.37,21.52 28.37,16.17 v28.19,15.99 | v33.48,11.81 33.62,11.67 35.48,11.67 R12.1 | v28.68,9.96 26.21,9.96 25.65,10.52 RX_SEL.1
TX  (via drill 0.3 pad 0.61)
  Top 0.254: RS485.4 24.13,13.51 25.81,11.83 28.56,11.83 29.27,12.54 v29.27,13.31 | v29.27,13.31
  Bottom 0.254: TX_SEL.2 30.48,12.34 30.23,12.34 v29.27,13.31
TX232  (via drill 0.3 pad 0.61)
  Top 0.254: R11.2 24.13,25.42 25.06,25.42 26.06,24.42 33.84,24.42 36.29,21.97 40.81,21.97 v43.33,19.44
  Bottom 0.254: IC4.5 43,19.11 v43.33,19.44
VCC  (via drill 0.3 pad 0.61)
  Top 0.406: 60.75,23.17 v62.15,24.57 | 60.75,23.17 59.49,24.43 57.22,24.43 56.21,23.42 56.21,22.85 U1.3.3V 52.49,22.85 52.49,22.37 52.13,22.01 | 60.75,23.17 62.01,21.91 RX.A TX.A | 52.13,22.01 53.41,20.73 v53.41,18.22 | v51.99,22.01 52.13,22.01 | RS485.8 27.94,10.31 29.9,12.28 29.9,13.01 RFM69W.VCC 31.39,13.01 32.8,13.01 32.8,13.02 v32.9,13.13 | v29.8,26.87 29,27.67 20.7,27.67 19.75,28.62 19.75,28.79 SV1.3 | OPT2.4 45.75,6.51 45.4,6.51 R8.2
  Bottom 0.406: IC31.18 33.75,17.02 32.58,17.02 | 32.58,17.02 32.57,17.02 32.15,17.02 IC31.20 32.15,13.88 v32.9,13.13 | 32.95,23.62 32.58,23.25 32.58,17.02 | 37.59,30.01 37.59,26.23 34.98,23.62 32.95,23.62 | 37.59,30.01 38.4,30.82 48.84,30.82 49.88,29.77 57.76,29.77 62.15,25.38 v62.15,24.57 | OPT.1 37.59,30.01 | 32.95,23.62 IC31.6 32.95,25.6 31.35,25.6 | v51.99,22.01 51.69,21.71 IC4.20 | v53.41,18.22 53.41,15.7 53.7,15.42 53.7,9.3 IC3.2 50.3,7.01 50.3,5.93 48.75,4.38 48.26,4.38 | 17.11,23.07 17.14,23.03 17.14,6.25 21.77,1.62 23.3,1.62 23.58,1.91 JP1.2 | 31.35,25.6 30.08,26.87 v29.8,26.87 | 42.58,8.78 41.75,9.61 41.75,10.64 41.55,10.85 39.74,10.85 C10.2 36.51,7.42 | C5.2 35.43,5.43 36.51,6.51 36.51,7.42 | 42.58,8.78 41.75,7.94 C31.1 | 45.4,8.78 42.58,8.78 | C10.2 36.51,7.42 | R34.1 45.4,8.78 | IC31.4 31.35,25.6 | 17.11,23.07 17.11,26.3 18.47,27.67 18.63,27.67 SV1.3 18.63,29.9 18.79,29.9 20.05,31.17 20.05,31.32 SV1.2 | 17.11,23.07 13.05,23.07 12.21,23.91 10.54,23.91 9.87,23.24 IC1.2 8.64,22.02 7.62,21.01 R6.1 | 45.4,8.78 R8.2 45.4,6.46 46.18,6.46 48.26,4.38 | OPT2.4 48.26,4.38
VCC1  (via drill 0.3 pad 0.61)
  Top 0.406: v33.87,8.92 33.95,9 39.05,9 R2.2
  Bottom 0.406: 32.63,5.71 32.63,3.99 31.98,3.34 27.38,3.34 25.95,1.91 JP1.1 | 27.43,6.99 28.45,6.99 29.72,5.71 IC2.3 32.63,5.71 | 32.63,5.71 32.63,7.68 v33.87,8.92 | 27.43,6.99 26.7,6.99 IC2.7 | IC2.8 27.43,8.26 27.43,6.99
VIN
  Top 0.406: U$3.TIP 53.59,6.46 F1.P$2 | 10.1,11.25 10.1,7.39 J1.2-7 11.15,6.12 13.35,3.92 20.36,3.92 20.47,4.03 22.94,4.03 23.05,3.92 25.72,3.92 26.52,4.71 28.64,4.71 29.22,5.29 41.88,5.29 OPT2.2 | J1.1-7 12.2,21.36 12.2,24.34 J1.1-3 | 10.1,11.25 10.98,11.25 J1.2-3 | X1.1 10.1,11.25
  Bottom 0.406: OPT2.2 45.03,2.15 49.83,2.15 51.64,3.95 U$3.TIP | J1.1-7 11.15,17.03 14.74,13.43 14.74,12.25 13.91,11.42 J1.2-3 | SV1.1 17.51,31.32 16.13,31.32 11.15,26.35 J1.1-3
VIN-FUSED  (via drill 0.3 pad 0.61)
  Top 0.406: v48.78,11.04 48.92,10.9 49.27,10.9 F1.P$1
  Bottom 0.406: IC3.3 49.12,8.37 49.12,10.7 v48.78,11.04 48.07,11.04 46.41,12.7 R1.1
VUSB  (via drill 0.3 pad 0.61)
  Top 0.254: v46.99,30.16 47.46,30.62 F2.1
  Bottom 0.254: v46.99,30.16 45.69,28.85 44.91,28.85 V_SEL.1
(copper drawn outside any net)
  shapes: Top area x1

### Text on the board
tNames: Fuse2 | USB | A4/SDA | A5 | GND | VCC | OPT | R4 | R11 | GND | RX | TX | B | ANT | A | RS485 | VIN | R2 | C4 | MysX | C32 | Fuse1 | GND | A7 | A6 | A2 | A1 | Reset | miniGW_RJ45 V0.1 | VIN | OPT1
bNames: Voltage Select | LOOP-B | LOOP-A | 5V | 3V3 | C14 | C15 | Crystal | FT232RL | ATSHA | C6 | R9 | R6 | ATMEGA328P | R10 | R5 | RXD | D8 | TXD | D9 | R1 | R12 | C31 | R34 | REG1117 | R3 | R7 | RX_Select | TX_Select | R8 | C10 | EEPROM | C5 | V-EEPROM
tDocu: 1 Vraw (typically unregulated voltage, either from motherboard to daughterboard or vice versa) Motherboard should have a jumper to cut onboard Vraw source if daughterboard provides Vraw. Be sure to check motherboard constraints on Vraw before connecting a daughterboard that provides Vraw (for over voltage protection). Should be able to source at least 100mA and all boards are recommended to support a voltage up to 24V on this pin. / 2 +3.3V fixed voltage (can source at least 100mA) / 3 VCCio (depending on MCU core voltage). Should not be used for heavy loads. / 4 GND / 5 MYSX_D1_DFM - Digital IO (USART TX (data from MCU)) / 6 MYSX_D2_DTM - Digital IO (USART RX (data to MCU)) / 7 MYSX_RST - Reset (On the board that carries the MCU, it is highly recommended that this pin has a 0.1uF capacitor in series for pulse “generation”) / 8 MYSX_LEGACY_ID – MYSX 1.x identification (2.0 daughterboards can tie this pin to VCC to allow the motherboard to determine if daughterboard is 1.x or 2.x. If identification is not needed or is undesired, pin can be used as regular analog input) / 9 MYSX_D3_INT - Digital IO (interrupt) / 10 MYSX_D4_INT - Digital IO (interrupt) / 11 MYSX_D5_PWM - Digital IO (PWM) / 12 MYSX_D6_PWM - Digital IO (PWM) / 13 MYSX_D7_SCL - Digital IO (I2C SCL) / 14 MYSX_D8_SDA - Digital IO (I2C SDA) / 15 MYSX_D9_A3 - Digital IO (analog input) / 16 MYSX_D10_A4 - Digital IO (analog input) / 17 MYSX_D11_MOSI - Digital IO (SPI MOSI) / 18 MYSX_D12_MISO - Digital IO (SPI MISO) / 19 MYSX_D13_SCK - Digital IO (SPI SCK) / 20 MYSX_D14_CS - Digital IO (also for SPI CS) / 21 MYSX_A5 - Analog input / 22 MYSX_A6 - Analog input
Name: I2C-CON | A2 | A1